# Altium schematic sheet Sheet1.SchDoc
size A; SheetNumber: 1; SheetTotal: 1
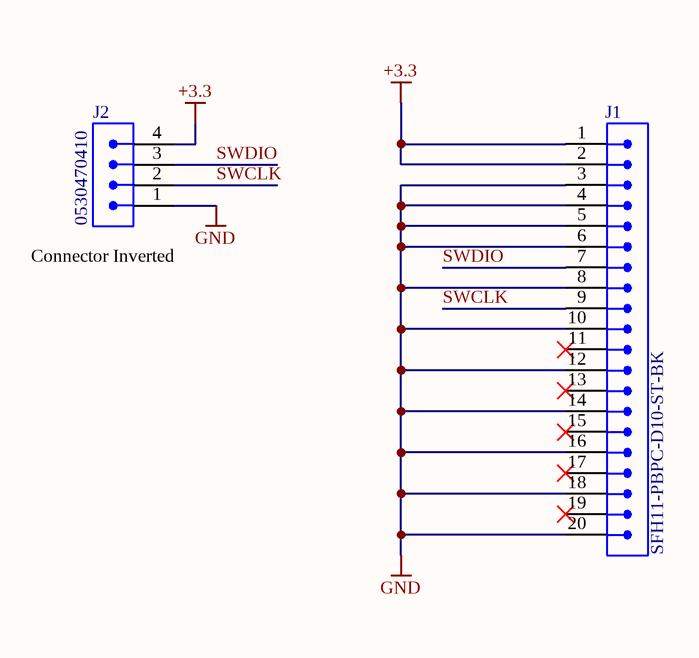
[diagram p0: Sheet1.SchDoc]

## Parts
J1  SFH11-PBPC-D10-ST-BK  [2x10]
J2  0530470410  [4POS]

## Nets
+3.3: J1.1 J1.2 J2.4
GND: J1.3 J1.4 J1.5 J1.6 J1.8 J1.10 J1.12 J1.14 J1.16 J1.18 J1.20 J2.1
SWCLK: J1.9 J2.2
SWDIO: J1.7 J2.3

Not connected (* = marked no-connect by the designer): J1 11* 13* 15* 17* 19*

## Notes on the sheet
- (near J2) Connector Inverted

## Library data of the parts
J1 = SFH11-PBPC-D10-ST-BK: 20 Position Header Connector 0.100" (2.54mm) Through Hole Gold
J2 = 0530470410: Connector Header Through Hole 4 position 0.049" (1.25mm)